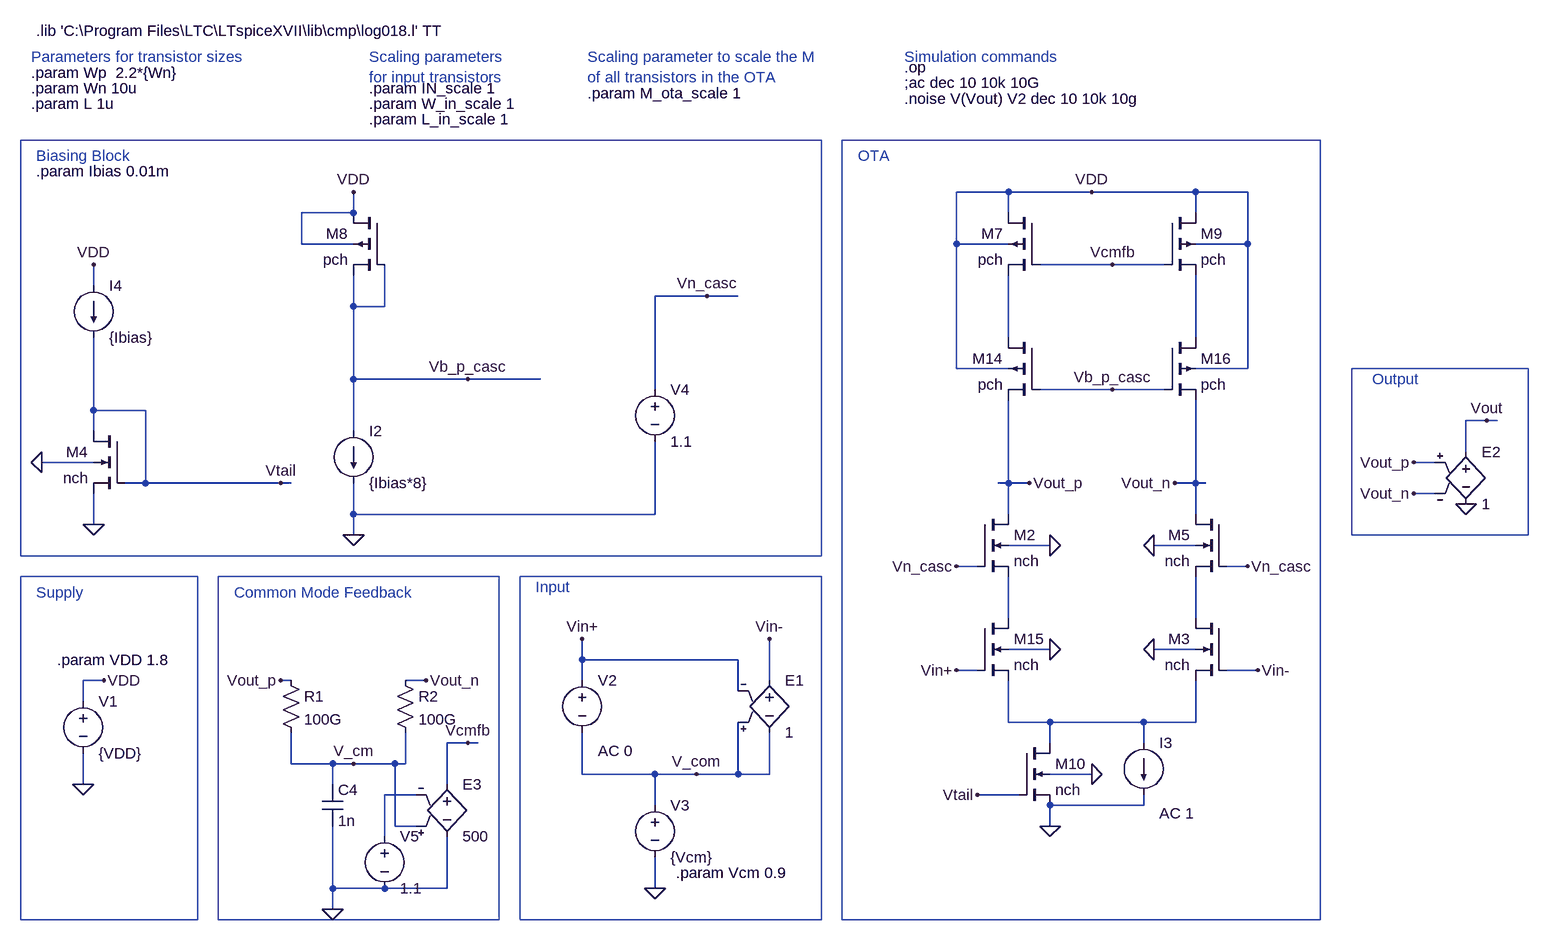
[diagram p0: schematic Week6_Ex2.asc]
Week6_Ex2.asc, the LTspice schematic file:
Version 4
SHEET 1 2076 1732
WIRE 288 464 208 464
WIRE 416 464 288 464
WIRE 576 464 416 464
WIRE 656 464 576 464
WIRE -720 496 -720 464
WIRE -720 496 -800 496
WIRE 288 496 288 464
WIRE 576 496 576 464
WIRE -800 544 -800 496
WIRE -720 544 -800 544
WIRE 208 544 208 464
WIRE 288 544 208 544
WIRE 656 544 656 464
WIRE 656 544 576 544
WIRE 448 576 336 576
WIRE 528 576 448 576
WIRE -1120 608 -1120 576
WIRE -176 624 -256 624
WIRE -128 624 -176 624
WIRE -720 640 -720 592
WIRE -672 640 -672 576
WIRE -672 640 -720 640
WIRE 288 688 288 592
WIRE 576 688 576 592
WIRE 208 736 208 544
WIRE 288 736 208 736
WIRE 656 736 656 544
WIRE 656 736 576 736
WIRE -720 752 -720 640
WIRE -544 752 -720 752
WIRE -432 752 -544 752
WIRE -256 768 -256 624
WIRE 448 768 336 768
WIRE 528 768 448 768
WIRE -1120 800 -1120 688
WIRE -1040 800 -1120 800
WIRE 1024 816 992 816
WIRE 1040 816 1024 816
WIRE -1120 832 -1120 800
WIRE -720 832 -720 752
WIRE 992 864 992 816
WIRE -1120 880 -1200 880
WIRE 944 880 912 880
WIRE -1040 912 -1040 800
WIRE -1040 912 -1072 912
WIRE -832 912 -1040 912
WIRE -816 912 -832 912
WIRE 288 912 288 784
WIRE 288 912 272 912
WIRE 320 912 288 912
WIRE 576 912 576 784
WIRE 576 912 544 912
WIRE 592 912 576 912
WIRE 944 928 912 928
WIRE -720 960 -720 912
WIRE -256 960 -256 848
WIRE -256 960 -720 960
WIRE 288 960 288 912
WIRE 576 960 576 912
WIRE -1120 976 -1120 928
WIRE -720 992 -720 960
WIRE 352 1008 288 1008
WIRE 576 1008 512 1008
WIRE 240 1040 208 1040
WIRE 656 1040 624 1040
WIRE 288 1120 288 1056
WIRE 576 1120 576 1056
WIRE 352 1168 288 1168
WIRE 576 1168 512 1168
WIRE -368 1184 -368 1152
WIRE -128 1184 -368 1184
WIRE 240 1200 208 1200
WIRE 672 1200 624 1200
WIRE -1104 1216 -1136 1216
WIRE -816 1216 -832 1216
WIRE -608 1216 -640 1216
WIRE -368 1216 -368 1184
WIRE -80 1216 -80 1152
WIRE -128 1232 -128 1184
WIRE -1136 1248 -1136 1216
WIRE 288 1280 288 1216
WIRE 352 1280 288 1280
WIRE 496 1280 352 1280
WIRE 576 1280 576 1216
WIRE 576 1280 496 1280
WIRE -544 1312 -576 1312
WIRE -528 1312 -544 1312
WIRE 352 1312 352 1280
WIRE 496 1312 496 1280
WIRE -816 1344 -816 1296
WIRE -752 1344 -816 1344
WIRE -720 1344 -752 1344
WIRE -656 1344 -720 1344
WIRE -640 1344 -640 1296
WIRE -640 1344 -656 1344
WIRE -368 1360 -368 1296
WIRE -256 1360 -368 1360
WIRE -192 1360 -256 1360
WIRE -128 1360 -128 1280
WIRE -128 1360 -192 1360
WIRE -80 1360 -80 1296
WIRE -80 1360 -128 1360
WIRE 416 1360 352 1360
WIRE -1136 1376 -1136 1328
WIRE -752 1376 -752 1344
WIRE -576 1376 -576 1312
WIRE -624 1392 -672 1392
WIRE 304 1392 240 1392
WIRE -256 1408 -256 1360
WIRE 496 1408 496 1392
WIRE 496 1408 352 1408
WIRE -656 1440 -656 1344
WIRE -624 1440 -656 1440
WIRE 352 1440 352 1408
WIRE -672 1456 -672 1392
WIRE -752 1536 -752 1440
WIRE -672 1536 -752 1536
WIRE -576 1536 -576 1456
WIRE -576 1536 -672 1536
WIRE -256 1536 -256 1488
WIRE -752 1568 -752 1536
FLAG -1136 1376 0
FLAG 352 1168 0
FLAG 320 912 Vout_p
FLAG 512 1168 0
FLAG 544 912 Vout_n
FLAG 352 1440 0
FLAG -368 1152 Vin+
FLAG -80 1152 Vin-
FLAG 208 1200 Vin+
FLAG 672 1200 Vin-
FLAG -1104 1216 VDD
FLAG 416 464 VDD
FLAG -1120 576 VDD
FLAG -1200 880 0
FLAG -1120 976 0
FLAG 416 1360 0
FLAG -256 1536 0
FLAG 912 880 Vout_p
FLAG 912 928 Vout_n
FLAG 992 944 0
FLAG 1024 816 Vout
FLAG 240 1392 Vtail
FLAG 352 1008 0
FLAG 512 1008 0
FLAG -832 912 Vtail
FLAG -720 464 VDD
FLAG -720 992 0
FLAG 448 576 Vcmfb
FLAG -192 1360 V_com
FLAG 448 768 Vb_p_casc
FLAG -544 752 Vb_p_casc
FLAG -832 1216 Vout_p
FLAG -608 1216 Vout_n
FLAG -720 1344 V_cm
FLAG 208 1040 Vn_casc
FLAG 656 1040 Vn_casc
FLAG -752 1568 0
FLAG -176 624 Vn_casc
FLAG -544 1312 Vcmfb
SYMBOL voltage -1136 1232 R0
WINDOW 123 0 0 Left 0
WINDOW 39 0 0 Left 0
SYMATTR InstName V1
SYMATTR Value {VDD}
SYMBOL voltage -368 1200 R0
WINDOW 123 24 124 Left 2
WINDOW 39 0 0 Left 0
SYMATTR Value2 AC 0
SYMATTR InstName V2
SYMATTR Value ""
SYMBOL nmos4 240 1120 R0
SYMATTR InstName M15
SYMATTR Value nch
SYMATTR Value2 l={L*IN_scale*L_in_scale} w={Wn} m={IN_scale*M_ota_scale*W_in_scale}
SYMBOL nmos4 624 1120 M0
SYMATTR InstName M3
SYMATTR Value nch
SYMATTR Value2 l={L*IN_scale*L_in_scale} w={Wn} m={IN_scale*M_ota_scale*W_in_scale}
SYMBOL current -1120 608 R0
WINDOW 123 0 0 Left 0
WINDOW 39 0 0 Left 0
SYMATTR InstName I4
SYMATTR Value {Ibias}
SYMBOL nmos4 -1072 832 M0
SYMATTR InstName M4
SYMATTR Value nch
SYMATTR Value2 l={L} w={Wn} m=1
SYMBOL nmos4 304 1312 R0
SYMATTR InstName M10
SYMATTR Value nch
SYMATTR Value2 l={L} w={Wn} m={2*M_ota_scale}
SYMBOL voltage -256 1392 R0
WINDOW 123 0 0 Left 0
WINDOW 39 0 0 Left 0
SYMATTR InstName V3
SYMATTR Value {Vcm}
SYMBOL e2 -80 1200 R0
SYMATTR InstName E1
SYMATTR Value 1
SYMBOL e 992 848 R0
SYMATTR InstName E2
SYMATTR Value 1
SYMBOL nmos4 240 960 R0
SYMATTR InstName M2
SYMATTR Value nch
SYMATTR Value2 l={L} w={Wn} m={M_ota_scale}
SYMBOL nmos4 624 960 M0
SYMATTR InstName M5
SYMATTR Value nch
SYMATTR Value2 l={L} w={Wn} m={M_ota_scale}
SYMBOL pmos4 336 496 M0
SYMATTR InstName M7
SYMATTR Value pch
SYMATTR Value2 l={L} w={Wp} m={M_ota_scale}
SYMBOL pmos4 528 496 R0
SYMATTR InstName M9
SYMATTR Value pch
SYMATTR Value2 l={L} w={Wp} m={M_ota_scale}
SYMBOL current -720 832 R0
WINDOW 123 0 0 Left 0
WINDOW 39 0 0 Left 0
SYMATTR InstName I2
SYMATTR Value {Ibias*8}
SYMBOL pmos4 -672 496 M0
SYMATTR InstName M8
SYMATTR Value pch
SYMATTR Value2 l={L} w={Wp} m=1
SYMBOL pmos4 336 688 M0
SYMATTR InstName M14
SYMATTR Value pch
SYMATTR Value2 l={L} w={Wp} m={M_ota_scale}
SYMBOL pmos4 528 688 R0
SYMATTR InstName M16
SYMATTR Value pch
SYMATTR Value2 l={L} w={Wp} m={M_ota_scale}
SYMBOL res -832 1200 R0
SYMATTR InstName R1
SYMATTR Value 100G
SYMBOL res -656 1200 R0
SYMATTR InstName R2
SYMATTR Value 100G
SYMBOL cap -768 1376 R0
SYMATTR InstName C4
SYMATTR Value 1n
SYMBOL current 496 1312 R0
WINDOW 123 24 108 Left 2
WINDOW 39 0 0 Left 0
SYMATTR Value2 AC 1
SYMATTR InstName I3
SYMATTR Value ""
SYMBOL voltage -256 752 R0
WINDOW 123 0 0 Left 0
WINDOW 39 0 0 Left 0
SYMATTR InstName V4
SYMATTR Value 1.1
SYMBOL e2 -576 1360 R0
SYMATTR InstName E3
SYMATTR Value 500
SYMBOL voltage -672 1440 R0
WINDOW 123 0 0 Left 0
WINDOW 39 0 0 Left 0
SYMATTR InstName V5
SYMATTR Value 1.1
TEXT -1208 216 Left 2 !.lib 'C:\\Program Files\\LTC\\LTspiceXVII\\lib\\cmp\\log018.l' TT
TEXT 128 272 Left 2 !.op
TEXT -1176 1184 Left 2 !.param VDD 1.8
TEXT 128 296 Left 2 !;ac dec 10 10k 10G
TEXT 128 320 Left 2 !.noise V(Vout) V2 dec 10 10k 10g
TEXT -1216 328 Left 2 !.param L 1u
TEXT -1216 280 Left 2 !.param Wp  2.2*{Wn}
TEXT -1216 304 Left 2 !.param Wn 10u
TEXT -696 304 Left 2 !.param IN_scale 1
TEXT -1208 432 Left 2 !.param Ibias 0.01m
TEXT -360 312 Left 2 !.param M_ota_scale 1
TEXT -696 328 Left 2 !.param W_in_scale 1
TEXT -696 352 Left 2 !.param L_in_scale 1
TEXT -1208 408 Left 2 ;Biasing Block
TEXT 56 408 Left 2 ;OTA
TEXT -904 1080 Left 2 ;Common Mode Feedback
TEXT -440 1072 Left 2 ;Input
TEXT 848 752 Left 2 ;Output
TEXT -1208 1080 Left 2 ;Supply
TEXT -1216 256 Left 2 ;Parameters for transistor sizes
TEXT -696 256 Left 2 ;Scaling parameters \nfor input transistors
TEXT -360 256 Left 2 ;Scaling parameter to scale the M \nof all transistors in the OTA
TEXT 128 256 Left 2 ;Simulation commands
TEXT -224 1512 Left 2 !.param Vcm 0.9
RECTANGLE Normal 0 1024 -1232 384
RECTANGLE Normal -1232 1056 -960 1584
RECTANGLE Normal -496 1584 -928 1056
RECTANGLE Normal 0 1584 -464 1056
RECTANGLE Normal 768 1584 32 384
RECTANGLE Normal 1088 992 816 736

The netlist it stands for:
* Week6_Ex2.asc
V1 VDD 0 {VDD}
V2 Vin+ V_com AC 0
M15 N003 Vin+ N005 0 nch l={L*IN_scale*L_in_scale} w={Wn} m={IN_scale*M_ota_scale*W_in_scale}
M3 N004 Vin- N005 0 nch l={L*IN_scale*L_in_scale} w={Wn} m={IN_scale*M_ota_scale*W_in_scale}
I4 VDD Vtail {Ibias}
M4 Vtail Vtail 0 0 nch l={L} w={Wn} m=1
M10 N005 Vtail 0 0 nch l={L} w={Wn} m={2*M_ota_scale}
V3 V_com 0 {Vcm}
E1 Vin- V_com V_com Vin+ 1
E2 Vout 0 Vout_p Vout_n 1
M2 Vout_p Vn_casc N003 0 nch l={L} w={Wn} m={M_ota_scale}
M5 Vout_n Vn_casc N004 0 nch l={L} w={Wn} m={M_ota_scale}
M7 VDD Vcmfb N001 VDD pch l={L} w={Wp} m={M_ota_scale}
M9 VDD Vcmfb N002 VDD pch l={L} w={Wp} m={M_ota_scale}
I2 Vb_p_casc 0 {Ibias*8}
M8 VDD Vb_p_casc Vb_p_casc VDD pch l={L} w={Wp} m=1
M14 N001 Vb_p_casc Vout_p VDD pch l={L} w={Wp} m={M_ota_scale}
M16 N002 Vb_p_casc Vout_n VDD pch l={L} w={Wp} m={M_ota_scale}
R1 Vout_p V_cm 100G
R2 Vout_n V_cm 100G
C4 V_cm 0 1n
I3 N005 0 AC 1
V4 Vn_casc 0 1.1
E3 Vcmfb 0 V_cm N006 500
V5 N006 0 1.1
.model NMOS NMOS
.model PMOS PMOS
.lib standard.mos
.lib 'C:\Program Files\LTC\LTspiceXVII\lib\cmp\log018.l' TT
.op
.param VDD 1.8
;ac dec 10 10k 10G
.noise V(Vout) V2 dec 10 10k 10g
.param L 1u
.param Wp  2.2*{Wn}
.param Wn 10u
.param IN_scale 1
.param Ibias 0.01m
.param M_ota_scale 1
.param W_in_scale 1
.param L_in_scale 1
* Biasing Block
* OTA
* Common Mode Feedback
* Input
* Output
* Supply
* Parameters for transistor sizes
* Scaling parameters
* for input transistors
* Scaling parameter to scale the M
* of all transistors in the OTA
* Simulation commands
.param Vcm 0.9
.backanno
.end